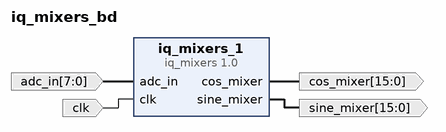
[diagram p0: block diagram of the top level]
# Vivado block design iq_mixers_bd, xc7s50csga324-2, Vivado 2018.3
create_bd_design iq_mixers_bd

create_bd_port -dir I -from 7 -to 0 -type data adc_in
create_bd_port -dir I -type clk clk
create_bd_port -dir O -from 15 -to 0 -type data cos_mixer
create_bd_port -dir O -from 15 -to 0 -type data sine_mixer

create_bd_cell -type ip -vlnv User_Company:SysGen:iq_mixers:1.0 iq_mixers_1

# ---- connections ----

connect_bd_net [get_bd_ports adc_in] [get_bd_pins iq_mixers_1/adc_in]
connect_bd_net [get_bd_ports clk] [get_bd_pins iq_mixers_1/clk]
connect_bd_net [get_bd_pins iq_mixers_1/cos_mixer] [get_bd_ports cos_mixer]
connect_bd_net [get_bd_pins iq_mixers_1/sine_mixer] [get_bd_ports sine_mixer]

validate_bd_design
save_bd_design
